# EAGLE design working (EAGLE 9.2.0)
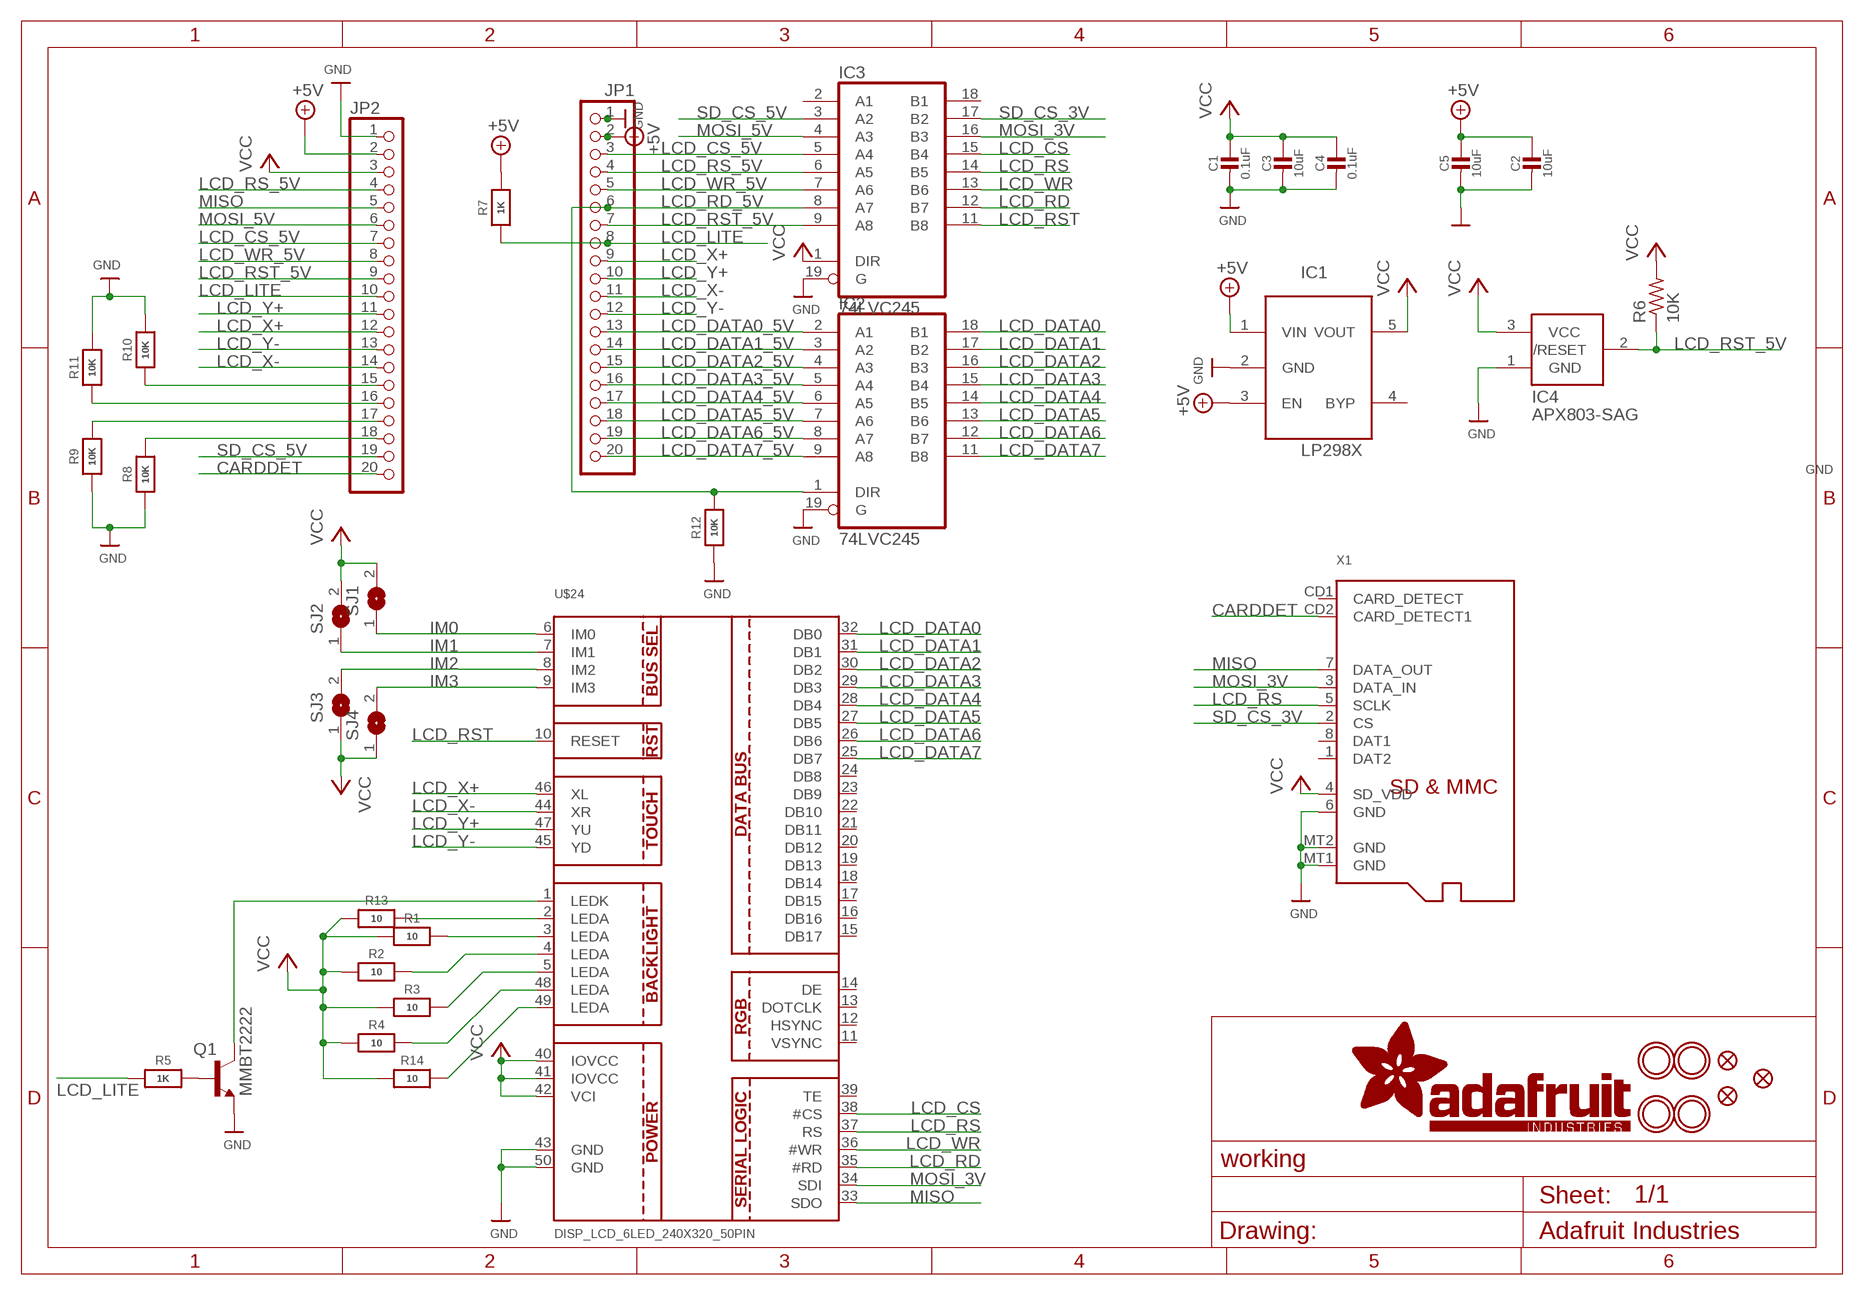
[diagram p0: schematic, sheet 1]

## Parts
C1  0.1uF  CAP_CERAMIC0805-NOOUTLINE  [0805-NO]
C2  10uF  CAP_CERAMIC0805-NOOUTLINE  [0805-NO]
C3  10uF  CAP_CERAMIC0805-NOOUTLINE  [0805-NO]
C4  0.1uF  CAP_CERAMIC0805-NOOUTLINE  [0805-NO]
C5  10uF  CAP_CERAMIC0805-NOOUTLINE  [0805-NO]
IC1  APA2112-3.3  LP298XS  [SOT23-5L]
IC2  74LVC245  74ACT245DW  [SO20W]
IC3  74LVC245  74ACT245DW  [SO20W]
IC4  APX803-SAG  AXP083-SAG  [SOT23]
JP1  HEADER-1X20ROUND  [1X20_ROUND]
JP2  HEADER-1X20ROUND  [1X20_ROUND]
Q1  MMBT2222  MMBT2222ALT1-NPN-SOT23-BEC  [SOT23-BEC]
R1  10  RESISTOR0805_NOOUTLINE  [0805-NO]
R2  10  RESISTOR0805_NOOUTLINE  [0805-NO]
R3  10  RESISTOR0805_NOOUTLINE  [0805-NO]
R4  10  RESISTOR0805_NOOUTLINE  [0805-NO]
R5  1K  RESISTOR0805_NOOUTLINE  [0805-NO]
R6  10K  R-US_R0805  [R0805]
R7  1K  RESISTOR0805_NOOUTLINE  [0805-NO]
R8  10K  RESISTOR0805_NOOUTLINE  [0805-NO]
R9  10K  RESISTOR0805_NOOUTLINE  [0805-NO]
R10  10K  RESISTOR0805_NOOUTLINE  [0805-NO]
R11  10K  RESISTOR0805_NOOUTLINE  [0805-NO]
R12  10K  RESISTOR0805_NOOUTLINE  [0805-NO]
R13  10  RESISTOR0805_NOOUTLINE  [0805-NO]
R14  10  RESISTOR0805_NOOUTLINE  [0805-NO]
SJ1  SOLDERJUMPER  [SOLDERJUMPER_ARROW_NOPASTE]
SJ2  SOLDERJUMPER  [SOLDERJUMPER_ARROW_NOPASTE]
SJ3  SOLDERJUMPER  [SOLDERJUMPER_ARROW_NOPASTE]
SJ4  SOLDERJUMPER  [SOLDERJUMPER_ARROW_NOPASTE]
U$7  MOUNTINGHOLE3.0THIN  [MOUNTINGHOLE_3.0_PLATEDTHIN]
U$9  FIDUCIAL""  [FIDUCIAL_1MM]
U$11  FIDUCIAL""  [FIDUCIAL_1MM]
U$15  MOUNTINGHOLE3.0THIN  [MOUNTINGHOLE_3.0_PLATEDTHIN]
U$16  MOUNTINGHOLE3.0THIN  [MOUNTINGHOLE_3.0_PLATEDTHIN]
U$17  MOUNTINGHOLE3.0THIN  [MOUNTINGHOLE_3.0_PLATEDTHIN]
U$23  FIDUCIAL""  [FIDUCIAL_1MM]
U$24  DISP_LCD_6LED_240X320_50PIN  [TFT_3.2IN_240X320_50PIN]
X1  MICROSD  [MICROSD]

## Nets
+5V: C2.1 C5.1 IC1.1(VIN) IC1.3(EN) JP1.2 JP2.2 R7.2
CARDDET: JP2.20 X1.CD2(CARD_DETECT1)
GND: C1.2 C2.2 C3.2 C4.2 C5.2 IC1.2(GND) IC2.19(G) IC3.19(G) IC4.1(GND) JP1.1 JP2.1 Q1.E R8.1 R9.1 R10.2 R11.2 R12.1 U$24.43(GND) U$24.50(GND) X1.6(GND) X1.MT1(GND) X1.MT2(GND)
IM0: JP2.18 R8.2 SJ1.1 U$24.6(IM0)
IM1: JP2.17 R9.2 SJ2.1 U$24.7(IM1)
IM2: JP2.16 R11.1 SJ3.2 U$24.8(IM2)
IM3: JP2.15 R10.1 SJ4.2 U$24.9(IM3)
LCD_CS: IC3.15(B4) U$24.38(#CS)
LCD_CS_5V: IC3.5(A4) JP1.3 JP2.7
LCD_DATA0: IC2.18(B1) U$24.32(DB0)
LCD_DATA0_5V: IC2.2(A1) JP1.13
LCD_DATA1: IC2.17(B2) U$24.31(DB1)
LCD_DATA1_5V: IC2.3(A2) JP1.14
LCD_DATA2: IC2.16(B3) U$24.30(DB2)
LCD_DATA2_5V: IC2.4(A3) JP1.15
LCD_DATA3: IC2.15(B4) U$24.29(DB3)
LCD_DATA3_5V: IC2.5(A4) JP1.16
LCD_DATA4: IC2.14(B5) U$24.28(DB4)
LCD_DATA4_5V: IC2.6(A5) JP1.17
LCD_DATA5: IC2.13(B6) U$24.27(DB5)
LCD_DATA5_5V: IC2.7(A6) JP1.18
LCD_DATA6: IC2.12(B7) U$24.26(DB6)
LCD_DATA6_5V: IC2.8(A7) JP1.19
LCD_DATA7: IC2.11(B8) U$24.25(DB7)
LCD_DATA7_5V: IC2.9(A8) JP1.20
LCD_LITE: JP1.8 JP2.10 R5.1 R7.1
LCD_RD: IC3.12(B7) U$24.35(#RD)
LCD_RD_5V: IC2.1(DIR) IC3.8(A7) JP1.6 R12.2
LCD_RS: IC3.14(B5) U$24.37(RS) X1.5(SCLK)
LCD_RS_5V: IC3.6(A5) JP1.4 JP2.4
LCD_RST: IC3.11(B8) U$24.10(RESET)
LCD_RST_5V: IC3.9(A8) IC4.2(/RESET) JP1.7 JP2.9 R6.1
LCD_WR: IC3.13(B6) U$24.36(#WR)
LCD_WR_5V: IC3.7(A6) JP1.5 JP2.8
LCD_X+: JP1.9 JP2.12 U$24.46(XL)
LCD_X-: JP1.11 JP2.14 U$24.44(XR)
LCD_Y+: JP1.10 JP2.11 U$24.47(YU)
LCD_Y-: JP1.12 JP2.13 U$24.45(YD)
MISO: JP2.5 U$24.33(SDO) X1.7(DATA_OUT)
MOSI_3V: IC3.16(B3) U$24.34(SDI) X1.3(DATA_IN)
MOSI_5V: IC3.4(A3) JP2.6
N$1: R4.2 U$24.48(LEDA)
N$2: R1.2 U$24.3(LEDA)
N$3: R2.2 U$24.4(LEDA)
N$4: R3.2 U$24.5(LEDA)
N$5: Q1.C U$24.1(LEDK)
N$6: R14.2 U$24.49(LEDA)
N$7: R13.2 U$24.2(LEDA)
N$16: Q1.B R5.2
SD_CS_3V: IC3.17(B2) X1.2(CS)
SD_CS_5V: IC3.3(A2) JP2.19
VCC: C1.1 C3.1 C4.1 IC1.5(VOUT) IC3.1(DIR) IC4.3(VCC) JP2.3 R1.1 R2.1 R3.1 R4.1 R6.2 R13.1 R14.1 SJ1.2 SJ2.2 SJ3.1 SJ4.1 U$24.40(IOVCC) U$24.41(IOVCC) U$24.42(VCI) X1.4(SD_VDD)
Unconnected: IC1.4(BYP) IC3.2(A1) IC3.18(B1) U$24.11(VSYNC) U$24.12(HSYNC) U$24.13(DOTCLK) U$24.14(DE) U$24.15(DB17) U$24.16(DB16) U$24.17(DB15) U$24.18(DB14) U$24.19(DB13) U$24.20(DB12) U$24.21(DB11) U$24.22(DB10) U$24.23(DB9) U$24.24(DB8) U$24.39(TE) X1.1(DAT2) X1.8(DAT1) X1.CD1(CARD_DETECT)

## Power pins joined to a net without a drawn wire
GND: IC2.10(GND) IC3.10(GND)
VCC: IC2.20(VCC) IC3.20(VCC)

## Library data of the parts
C1-C5 = microbuilder:CAP_CERAMIC: Ceramic Capacitors For new designs, use the packages preceded by an '_' character since they are more reliable: The following footprints should be used on most boards: _0402 - Standard footprint for regular board layouts _0603 - Standard footprint for regular board layouts _0805 - Standard footprint for regular board layouts _1206 - Standard footprint for regular board layouts For extremely tight-pitch boards where space is at a premium, the following 'micro-pitch' footprints can be used (smaller pads, no silkscreen outline, etc.): _0402MP - Micro-pitch footprint for very dense/compact boards _0603MP - Micro-pitch footprint for very dense/compact boards _0805MP - Micro-pitch footprint for very dense/compact boards _1206MP - Micro-pitch footprint for very dense/compact boards
IC1 = adafruit:LP298X
IC2 IC3 = 74xx-eu:74*245: Octal BUS TRANSCEIVER, 3-state
IC4 = adafruit:AXP083
JP1 JP2 = microbuilder:HEADER-1X20
Q1 = transistor-neu-to92:*-NPN-: NPN Transistror
R1-R5 R7-R14 = microbuilder:RESISTOR: Resistors For new designs, use the packages preceded by an '_' character since they are more reliable: The following footprints should be used on most boards: _0402 - Standard footprint for regular board layouts _0603 - Standard footprint for regular board layouts _0805 - Standard footprint for regular board layouts _1206 - Standard footprint for regular board layouts For extremely tight-pitch boards where space is at a premium, the following 'micro-pitch' footprints can be used (smaller pads, no silkscreen outline, etc.): _0402MP - Micro-pitch footprint for very dense/compact boards _0603MP - Micro-pitch footprint for very dense/compact boards _0805MP - Micro-pitch footprint for very dense/compact boards _1206MP - Micro-pitch footprint for very dense/compact boards
R6 = rcl:R-US_: RESISTOR, American symbol
SJ1-SJ4 = microbuilder:SOLDERJUMPER: SMD Solder JUMPER Solder the two pads together to create a connection, or remove the solder to break it. REFLOW - Use this footprint for solder paste and reflow ovens. WAVE - Use this footprint for hand-soldering (larger pads). CLOSED - Has a trace between the two pads to ensure it is closed by default. The trace needs to be cut to disable the jumper, and can be closed again by creating a solder bridge between the two pads.; BOM: EXCLUDE
U$7 U$15-U$17 = microbuilder:MOUNTINGHOLE: Mounting Hole For #2 screws (0.086"/2.18mm width, 0.094"/2.4mm hole) use 2.5mm; BOM: EXCLUDE
U$9 U$11 U$23 = microbuilder:FIDUCIAL: Fiducial Alignment Points Various fiducial points for machine vision alignment.; BOM: EXCLUDE
U$24 = microbuilder:DISP_LCD_6LED_240X320_50PIN
X1 = microbuilder:MICROSD: MicroSD/Transflash Card Holder with SPI pinout 3M: 2908-05WB-MG 4UConnector: 19656 Footprint courtesy: Adafruit Industries

## Board
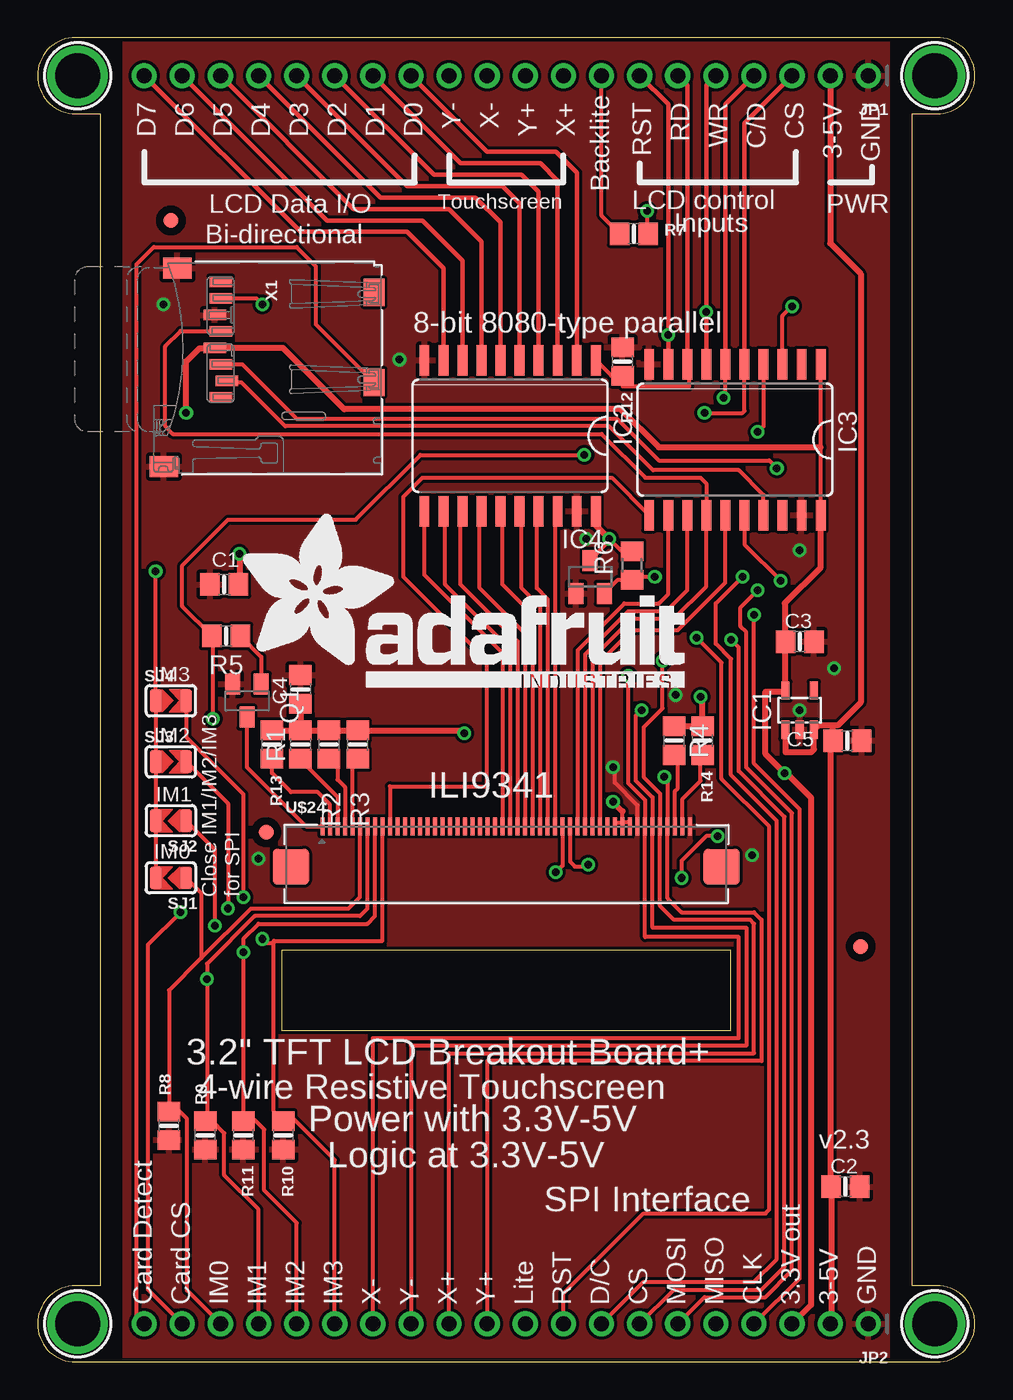
[diagram p1: board, top side]
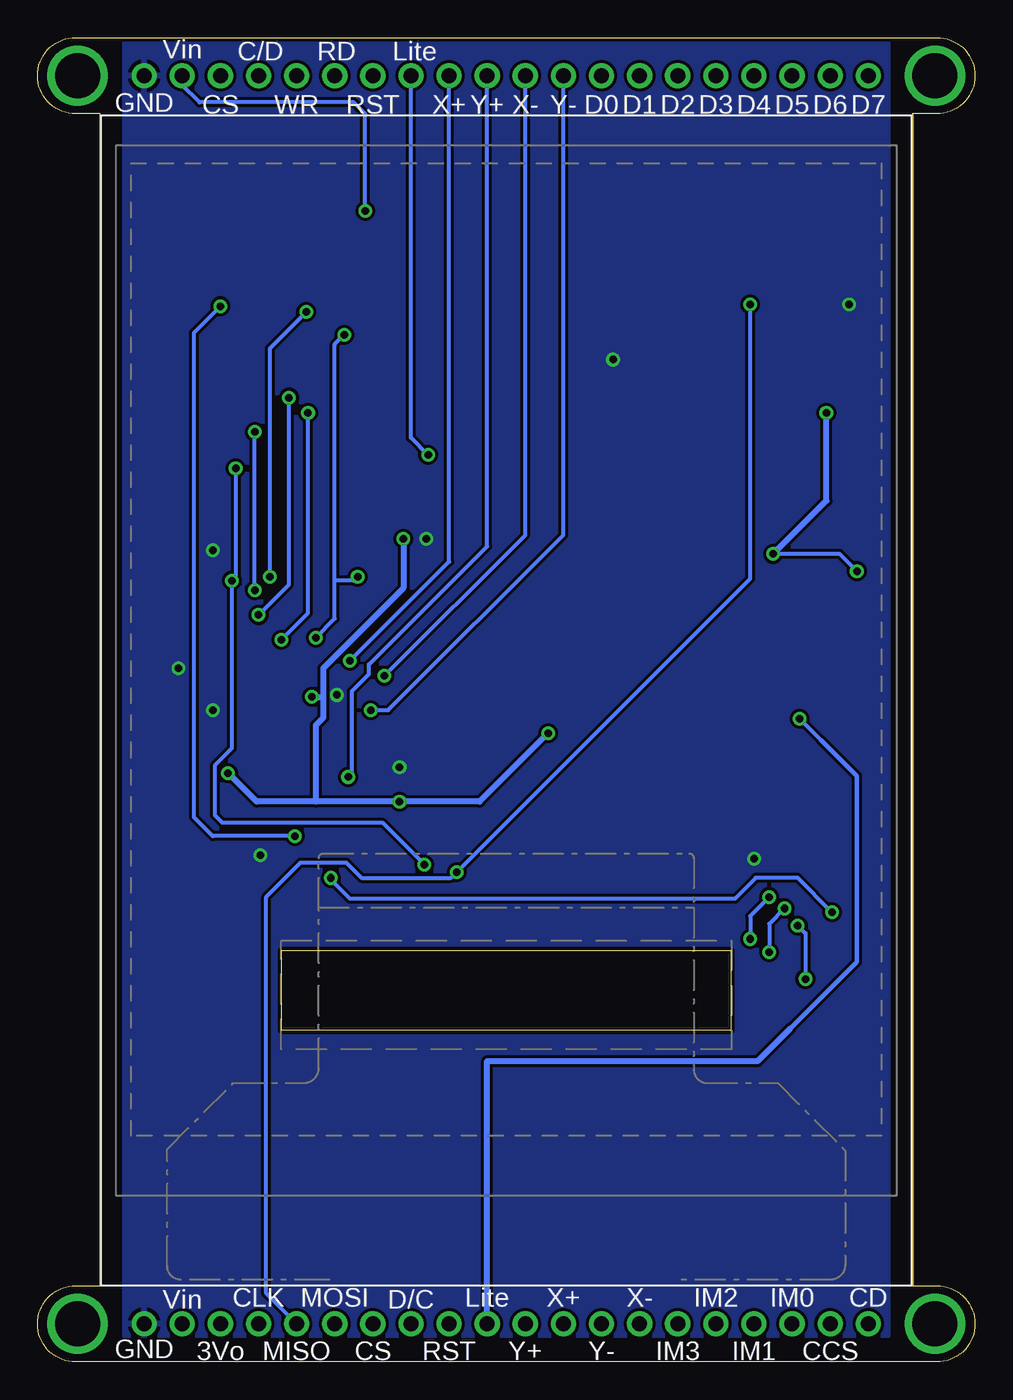
[diagram p2: board, bottom side, seen from below]

Size 62.48 x 88.27 mm. Coordinates in mm from the lower left corner, seen from the top.
Outline: 0,2.54 arc90 2.54,0 59.94,0 arc90 62.48,2.54 arc90 59.94,5.08 58.29,5.08 58.29,83.19 59.94,83.19 arc90 62.48,85.72 arc90 59.94,88.27 2.54,88.27 arc90 0,85.72 arc90 2.54,83.19 4.19,83.19 4.19,5.08 2.54,5.08 arc90 0,2.54
Outline: 16.26,27.43 16.26,22.1 46.23,22.1 46.23,27.43 16.26,27.43
Copper layers (1*16): Top 0.035mm / dielectric 1.5mm / Bottom 0.035mm
Design rules "adafruit *": minimum track width 8mil, minimum drill 15.5mil, track to track 8mil, track to pad 8mil, pad to pad 8mil, via to via 8mil, smd to smd 8mil, copper to edge 10mil, drill to drill 8mil, minimum pad ring 10mil, minimum via ring 8mil, stop-mask expansion 4mil, vias tented up to drill 20mil, thermal gap 10mil

### Footprints (pad centres in the part's own frame; a part is rotated, then mirrored left to right if it is on the bottom)
0805-NO = smd 1.3 x 1.5: 1 -0.95,0; 2 0.95,0
SOT23-5L = smd 0.55 x 1.2: 1 -0.95,-1.3; 2 0,-1.3; 3 0.95,-1.3; 4 0.95,1.3; 5 -0.95,1.3
SO20W = smd 0.66 x 2.032: 1 -5.715,-5.029; 2 -4.445,-5.029; 3 -3.175,-5.029; 4 -1.905,-5.029; 5 -0.635,-5.029; 6 0.635,-5.029; 7 1.905,-5.029; 8 3.175,-5.029; 9 4.445,-5.029; 10 5.715,-5.029; 11 5.715,5.029; 12 4.445,5.029; 13 3.175,5.029; 14 1.905,5.029; 15 0.635,5.029; 16 -0.635,5.029; 17 -1.905,5.029; 18 -3.175,5.029; 19 -4.445,5.029; 20 -5.715,5.029
SOT23 = smd 1 x 1.4: 1 -0.95,-1.1; 2 0.95,-1.1; 3 0,1.1
1X20_ROUND = drill 1 pad 1.676: 1 -24.13,0; 2 -21.59,0; 3 -19.05,0; 4 -16.51,0; 5 -13.97,0; 6 -11.43,0; 7 -8.89,0; 8 -6.35,0; 9 -3.81,0; 10 -1.27,0; 11 1.27,0; 12 3.81,0; 13 6.35,0; 14 8.89,0; 15 11.43,0; 16 13.97,0; 17 16.51,0; 18 19.05,0; 19 21.59,0; 20 24.13,0
SOT23-BEC = smd 1 x 1.4: B -0.95,-1.1; C 0,1.1; E 0.95,-1.1
R0805 = smd 1.3 x 1.5: 1 -0.95,0; 2 0.95,0
SOLDERJUMPER_ARROW_NOPASTE = smd 0.762 x 1.524: 1 -1.016,0; 2 1.016,0
MOUNTINGHOLE_3.0_PLATEDTHIN = drill 3 pad 3.6: P$1 0,0
FIDUCIAL_1MM = smd 1 x 1: 1 0,0
TFT_3.2IN_240X320_50PIN = smd 0.275 x 1.2 bottom: 1 12.25,-9.39; 2 11.75,-9.39; 3 11.25,-9.39; 4 10.75,-9.39; 5 10.25,-9.39; 6 9.75,-9.39; 7 9.25,-9.39; 8 8.75,-9.39; 9 8.25,-9.39; 10 7.75,-9.39; 11 7.25,-9.39; 12 6.75,-9.39; 13 6.25,-9.39; 14 5.75,-9.39; 15 5.25,-9.39; 16 4.75,-9.39; 17 4.25,-9.39; 18 3.75,-9.39; 19 3.25,-9.39; 20 2.75,-9.39; 21 2.25,-9.39; 22 1.75,-9.39; 23 1.25,-9.39; 24 0.75,-9.39; 25 0.25,-9.39; 26 -0.25,-9.39; 27 -0.75,-9.39; 28 -1.25,-9.39; 29 -1.75,-9.39; 30 -2.25,-9.39; 31 -2.75,-9.39; 32 -3.25,-9.39; 33 -3.75,-9.39; 34 -4.25,-9.39; 35 -4.75,-9.39; 36 -5.25,-9.39; 37 -5.75,-9.39; 38 -6.25,-9.39; 39 -6.75,-9.39; 40 -7.25,-9.39; 41 -7.75,-9.39; 42 -8.25,-9.39; 43 -8.75,-9.39; 44 -9.25,-9.39; 45 -9.75,-9.39; 46 -10.25,-9.39; 47 -10.75,-9.39; 48 -11.25,-9.39; 49 -11.75,-9.39; 50 -12.25,-9.39 | smd 2.4 x 2.4 bottom: PAD1 14.35,-12.09; PAD2 -14.35,-12.09
MICROSD = smd 0.7 x 1.5: 1 9,-10.64; 2 7.9,-10.24; 3 6.8,-10.64; 4 5.7,-11.04; 5 4.6,-10.64; 6 3.5,-11.04; 7 2.4,-10.64; 8 1.3,-10.64 | smd 1.8 x 1.4: CD1 2,-0.44; CD2 8,-0.44 | smd 1.4 x 1.9: MT1 0.4,-13.54; MT2 13.6,-14.44

### Placement (x,y rotation side)
C1  12.45,51.82 180 top
C2  53.85,11.68 0 top
C3  50.8,48.01 0 top
C4  17.53,44.83 90 top
C5  53.98,41.4 0 top
IC1  50.8,43.43 0 top
IC2  31.5,61.72 180 top
IC3  46.48,61.47 180 top
IC4  36.83,52.32 0 top
JP1  31.24,85.72 180 top
JP2  31.24,2.54 180 top
Q1  13.97,44.07 180 top
R1  17.53,41.15 270 top
R2  19.43,41.15 270 top
R3  21.34,41.15 270 top
R4  42.42,41.4 270 top
R5  12.57,48.39 0 top
R6  39.62,53.09 90 top
R7  39.75,75.18 0 top
R8  8.76,15.75 90 top
R9  11.18,15.11 90 top
R10  16.38,15.11 270 top
R11  13.72,15.11 270 top
R12  38.99,66.67 270 top
R13  15.62,41.15 270 top
R14  44.32,41.4 270 top
SJ1  8.89,32.26 180 top
SJ2  8.89,36.07 180 top
SJ3  8.89,40.01 0 top
SJ4  8.89,44.07 0 top
U$7  2.67,2.54 0 top
U$9  54.86,27.69 0 top
U$11  8.89,76.07 0 top
U$15  59.82,2.54 0 top
U$16  2.67,85.72 0 top
U$17  59.82,85.72 0 top
U$19  [ADAFRUIT_TEXT_30MM]  13.46,44.96 0 top
U$23  15.24,35.31 0 top
U$24  31.24,45.09 0 bottom
X1  22.86,73.28 270 top

### Tracks (layer width: path | path; a pad name or v marks a point on that pad's centre or on a via)
+5V  (via drill 0.5)
  Top 0.254: R7.2 40.64,75.25 v40.64,76.71
  Top 0.406: JP1.2 52.83,74.55 54.86,72.52 54.86,43.94 53.34,42.42 52.96,42.42 | 52.96,42.42 52.03,42.42 IC1.3 51.75,40.83 51.56,40.64 49.85,40.64 IC1.1 | 52.85,2.56 JP2.2 52.9,2.61 C2.1 52.83,11.75 52.83,41.21 C5.1 53.03,42.35 52.96,42.42
  Bottom 0.254: v40.64,76.71 40.64,83.19 41.4,83.95 51.69,83.95 52.83,85.09 JP1.2
CARDDET
  Top 0.254: JP2.20 6.6,3.05 6.6,73.15 7.75,74.3 17.27,74.3 18.54,73.03 18.54,69.16 X1.CD2
GND  (via drill 0.5)
  Top 0.254: U$24.43 39.99,37.1 38.48,38.61 38.48,39.5 v38.35,39.62
  other vias: 36.58,54.86 50.8,54.1 42.55,44.45 50.8,43.43 53.09,46.23 14.73,33.53 8.38,70.48 24.13,66.8 47.62,33.78
  pour Top: 5.84,88.27 5.84,0 56.64,0 56.64,88.27
  pour Bottom: 5.84,88.01 5.84,1.78 56.64,1.78 56.64,88.01
IM0
  Top 0.254: 10.92,26.92 8.76,24.77 R8.2 9.46,16.7 9.97,16.2 9.97,4.77 JP2.18 | 10.92,26.92 14.22,30.23 20.73,30.23 21.49,30.99 U$24.6 | SJ1.1 10.92,31.24 10.92,26.92
IM1  (via drill 0.5)
  Top 0.254: JP2.17 14.73,10.16 12.45,12.45 12.45,15.24 11.62,16.06 R9.2 11.3,16.19 v11.3,25.53 | SJ2.1 11.81,34.16 v11.81,29.08 | v11.3,25.53 11.29,25.51 | U$24.7 21.99,30.23 21.48,29.72 14.48,29.72 11.3,26.54 v11.3,25.53
  Bottom 0.254: v11.81,29.08 11.3,28.57 v11.3,25.53
IM2  (via drill 0.5)
  Top 0.254: JP2.16 17.27,9.27 15.11,11.43 15.11,15.49 14.48,16.13 13.72,16.13 | 13.72,16.13 13.66,16.13 | SJ3.2 12.7,37.21 v12.7,30.23 | U$24.8 22.49,29.72 21.98,29.21 14.73,29.21 13.72,28.19 v13.72,27.3 13.72,16.13 | R11.1 13.72,16.13
  Bottom 0.254: v12.7,30.23 13.72,29.21 v13.72,27.3
IM3  (via drill 0.5)
  Top 0.254: JP2.15 19.81,13.46 17.02,16.26 16.58,16.26 R10.1 15.75,16.7 15.75,27.94 | 15.75,27.94 15.75,28.07 22.99,28.07 U$24.9 | 9.91,44.45 SJ4.2 9.91,41.66 13.72,37.85 v13.72,30.99 | v14.99,28.19 15.24,27.94 15.75,27.94
  Bottom 0.254: v13.72,30.99 14.99,29.72 v14.99,28.19
LCD_CS
  Top 0.254: 45.97,56.31 IC3.15 45.85,51.94 42.67,48.77 39.62,48.77 37.49,46.64 U$24.38
LCD_CS_5V  (via drill 0.5)
  Top 0.254: JP2.7 42.42,4.83 48.26,4.83 49.78,6.35 49.78,36.32 46.74,39.37 46.74,47.62 v46.23,48.13 | v44.45,63.25 46.99,63.25 47.12,63.37 IC3.5
  Top 0.305: JP1.3 47.12,82.55 IC3.5
  Bottom 0.254: v46.23,48.13 44.45,49.91 v44.45,63.25
LCD_DATA0
  Top 0.254: IC2.18 34.49,56.51 U$24.32
LCD_DATA0_5V
  Top 0.305: JP1.13 29.97,80.65 34.54,80.65 35.94,79.25 IC2.2
LCD_DATA1
  Top 0.254: IC2.17 33.27,56.57 33.27,51.56 33.99,50.84 U$24.31
LCD_DATA1_5V
  Top 0.305: JP1.14 28.19,79.88 33.53,79.88 34.67,78.74 IC2.3
LCD_DATA2
  Top 0.254: IC2.16 32.26,56.57 32.26,51.56 33.49,50.33 U$24.30
LCD_DATA2_5V
  Top 0.305: JP1.15 26.42,79.12 32.26,79.12 33.4,77.98 IC2.4
LCD_DATA3
  Top 0.254: IC2.15 30.99,56.57 30.99,51.82 32.99,49.81 U$24.29
LCD_DATA3_5V
  Top 0.305: JP1.16 24.64,78.36 30.99,78.36 32.13,77.22 IC2.5
LCD_DATA4
  Top 0.254: IC2.14 29.46,56.57 29.46,51.56 32.49,48.53 U$24.28
LCD_DATA4_5V
  Top 0.305: JP1.17 22.86,77.6 29.21,77.6 30.86,75.95 IC2.6
LCD_DATA5
  Top 0.254: IC2.13 28.19,56.57 28.19,51.82 31.99,48.02 U$24.27
LCD_DATA5_5V
  Top 0.305: JP1.18 21.08,76.84 27.43,76.84 29.59,74.68 IC2.7
LCD_DATA6
  Top 0.254: IC2.12 27.18,56.57 27.18,51.82 31.49,47.5 U$24.26
LCD_DATA6_5V
  Top 0.305: JP1.19 19.3,76.07 25.65,76.07 28.32,73.41 IC2.8
LCD_DATA7
  Top 0.254: IC2.11 25.78,52.45 30.99,47.24 U$24.25
LCD_DATA7_5V
  Top 0.305: JP1.20 17.53,75.31 24.64,75.31 27.05,72.9 IC2.9
LCD_LITE  (via drill 0.5)
  Top 0.254: v36.45,60.45 25.53,60.45 21.21,56.13 12.7,56.13 9.65,53.09 9.65,50.36 R5.1 11.68,48.33 v11.68,42.86 | R7.1 37.59,76.39 JP1.8
  Bottom 0.254: v36.45,60.45 37.59,61.59 JP1.8 | v11.68,42.86 10.29,41.46
  Bottom 0.305: 12.32,22.23 7.87,26.67 7.87,39.05 10.29,41.46
  Bottom 0.406: JP2.10 32.51,20.07 14.48,20.07 12.32,22.23
LCD_RD
  Top 0.254: 41.91,56.31 IC3.12 42.04,51.18 41.4,50.55 39.12,50.55 35.99,47.42 U$24.35
LCD_RD_5V
  Top 0.254: IC3.8 43.43,66.37 43.43,65.02 38.99,65.02 R12.2 | R12.2 38.99,66.04 38.86,65.91 | IC2.1 38.24,65.72 R12.2
  Top 0.305: JP1.6 43.31,85.09 IC3.8
LCD_RS
  Top 0.254: 44.45,56.31 IC3.14 | IC3.14 44.58,51.69 42.42,49.53 39.62,49.53 36.99,46.9 U$24.37 | IC3.14 44.58,58.55 44.2,58.93 40.51,58.93 37.59,61.85 9.02,61.85 8.51,62.36 8.51,67.69 9.53,68.71 12.19,68.71 X1.5
LCD_RS_5V  (via drill 0.5)
  Top 0.254: v47.75,49.78 47.75,39.88 50.8,36.83 50.8,5.59 JP2.4 | v45.72,64.26 45.85,64.39 IC3.6
  Top 0.305: JP1.4 45.85,83.82 IC3.6
  Bottom 0.254: v47.75,49.78 45.72,51.82 v45.72,64.26
LCD_RST
  Top 0.254: IC3.11 38.28,58.93 25.65,58.93 24.38,57.66 24.38,52.32 29.97,46.74 29.97,38.35 23.49,38.35 U$24.10
LCD_RST_5V  (via drill 0.5)
  Top 0.254: JP2.9 35.05,4.57 40.39,9.91 48.51,9.91 48.77,10.16 48.77,35.69 45.59,38.86 45.59,46.61 v43.94,48.26 | v42.04,68.45 IC3.9 | IC4.2 38.69,52.14 R6.1 39.81,52.32 v41.15,52.32
  Top 0.305: JP1.7 42.04,83.82 IC3.9
  Bottom 0.254: v43.94,48.26 42.67,49.53 42.67,52.07 | 42.67,52.07 42.67,67.82 v42.04,68.45 | v41.15,52.32 41.4,52.07 42.67,52.07
LCD_WR
  Top 0.254: 43.43,56.31 IC3.13 43.31,51.44 41.91,50.04 39.37,50.04 36.49,47.16 U$24.36
LCD_WR_5V  (via drill 0.5)
  Top 0.254: JP2.8 40.39,5.33 47.75,5.33 49.28,6.86 49.28,36.07 46.23,39.12 46.23,46.86 45.21,47.88 45.21,50.55 v46.99,52.32 | 44.7,66.37 IC3.7
  Top 0.305: JP1.5 44.58,85.09 v44.58,69.98 IC3.7
  Bottom 0.254: v46.99,52.32 46.99,67.56 v44.58,69.98
LCD_X+  (via drill 0.5)
  Top 0.254: v41.66,46.74 41.66,43.56 40.39,42.29 40.39,38.99 41.49,37.88 U$24.46 41.49,30.39 42.42,29.46 47.5,29.46 47.75,29.21 47.75,20.57 27.43,20.57 JP2.12
  Bottom 0.254: v41.66,46.74 35.05,53.34 JP1.9
LCD_X-  (via drill 0.5)
  Top 0.254: v39.37,45.72 39.37,38.57 40.49,37.44 U$24.44 40.49,28.32 46.74,28.32 46.74,21.59 22.35,21.59 JP2.14
  Bottom 0.254: v39.37,45.72 29.97,55.12 JP1.11
LCD_Y+  (via drill 0.5)
  Top 0.254: JP2.11 29.97,20.07 48.26,20.07 48.26,29.46 47.75,29.97 42.93,29.97 41.99,30.91 U$24.47 41.99,38.82 41.95,38.82 v41.78,38.99
  Bottom 0.254: JP1.10 32.51,54.36 40.39,46.48 40.39,45.85 41.53,44.7 41.53,39.24 v41.78,38.99
LCD_Y-  (via drill 0.5)
  Top 0.254: JP2.13 24.89,21.08 47.24,21.08 47.24,28.96 40.99,28.96 U$24.45 40.99,37.62 39.88,38.73 39.88,43.05 v40.26,43.43
  Bottom 0.254: v40.26,43.43 39.12,43.43 27.43,55.12 JP1.12
MISO  (via drill 0.5)
  Top 0.254: v14.99,70.48 14.59,70.88 X1.7 | U$24.33 34.99,33.09 v34.54,32.64
  Bottom 0.254: JP2.5 47.24,4.57 47.24,30.99 44.96,33.27 41.91,33.27 40.89,32.26 34.92,32.26 v34.54,32.64 14.99,52.2 v14.99,70.48
MOSI_3V  (via drill 0.5)
  Top 0.254: IC3.16 47.12,54.48 v49.53,52.07 | v49.28,59.56 48.77,60.07 41.4,60.07 38.61,62.86 17.27,62.86 13.66,66.48 X1.3 | U$24.34 35.49,33.34 35.81,33.02 36.58,33.02 v36.7,33.15
  Bottom 0.254: v36.7,33.15 39.5,35.94 50.16,35.94 50.67,36.45 50.67,39.75 49.53,40.89 v49.53,52.07 49.28,52.32 v49.28,59.56
MOSI_5V  (via drill 0.5)
  Top 0.254: JP2.6 44.45,4.32 48.51,4.32 50.29,6.1 50.29,36.58 47.24,39.62 47.24,48.64 46.86,49.02 46.86,50.29 v48.01,51.44 | IC3.4 48.39,62.36 v48.01,61.98
  Bottom 0.254: v48.01,51.44 v48.01,61.98
N$1
  Top 0.254: U$24.48 42.49,38.05 42.67,38.23 42.67,40.2 R4.2
N$2
  Top 0.254: R1.2 17.78,39.94 17.78,39.88 19.99,37.67 U$24.3
N$3
  Top 0.254: R2.2 19.99,39.64 19.99,38.81 20.49,38.31 U$24.4
N$4
  Top 0.254: U$24.5 20.99,39.85 R3.2
N$5
  Top 0.254: Q1.C 13.97,39.62 17.9,35.7 U$24.1
N$6
  Top 0.254: U$24.49 42.99,37.53 44.2,38.73 44.2,40.45 R14.2
N$7
  Top 0.254: U$24.2 19.49,37.15 18.67,37.97 16.89,37.97 15.62,39.24 R13.2
N$16
  Top 0.254: R5.2 14.92,46.99 Q1.B
SD_CS_3V
  Top 0.254: IC3.17 48.39,57.78 46.74,59.44 41.02,59.44 38.1,62.36 16.51,62.36 13.59,65.28 12.72,65.28 X1.2
SD_CS_5V  (via drill 0.5)
  Top 0.254: IC3.3 49.66,69.72 v50.29,70.36 | JP2.19 7.37,4.83 7.37,27.81 v9.53,29.97 | v45.34,35.05 44.58,35.05 42.93,33.4 v42.93,32.26
  Bottom 0.254: v50.29,70.36 52.07,68.58 52.07,36.32 50.8,35.05 v45.34,35.05 | v42.93,32.26 42.93,32.13 41.66,30.86 16,30.86 14.61,32.26 11.81,32.26 v9.53,29.97
VCC  (via drill 0.5)
  Top 0.254: IC3.20 52.2,60.96 IC3.1 | SJ2.2 SJ3.1 SJ4.1 v7.87,52.7 | 7.87,35.56 SJ2.2 | SJ2.2 SJ1.2 | U$24.40 38.49,35.94 38.99,35.94 | U$24.42 39.49,35.94 38.99,35.94 | 38.99,35.94 38.99,36.7 | IC4.3 38.1,54.69 v38.1,54.86 38.93,54.04 R6.2 | 38.99,35.94 U$24.41
  Top 0.406: IC3.20 52.2,52.96 49.8,50.56 49.8,48.06 C3.1 IC1.5 49.78,44.67 48.51,44.67 48.51,40.51 v49.78,39.24 49.8,39.24 49.8,39.35 51.56,37.59 51.56,3.81 JP2.3 | R1.1 R2.1 R3.1 28.26,42.1 v28.45,41.91 | v38.35,37.34 38.99,36.7 | 52.2,60.96 41.4,60.96 38.86,63.5 20.45,63.5 16.37,67.58 X1.4 11.8,67.56 10.8,67.56 9.91,66.67 v9.91,63.25 10.02,63.13 | IC2.20 37.21,55.75 v38.1,54.86 | R13.1 R1.1 | C4.1 R1.1 | R4.1 R14.1 44.32,44.2 v44.2,44.32 | v13.46,53.85 13.46,51.88 C1.1
  Bottom 0.254: v7.87,52.7 9.02,53.85 v13.46,53.85
  Bottom 0.406: v28.45,41.91 33.02,37.34 v38.35,37.34 43.94,37.34 | 43.94,37.34 47.88,37.34 v49.78,39.24 | 43.43,44.32 43.43,46.23 38.1,51.56 v38.1,54.86 | 43.43,44.32 43.43,42.93 43.94,42.42 43.94,37.34 | v13.46,53.85 9.91,57.4 v9.91,63.25 | v44.2,44.32 43.43,44.32

### Text on the board
tPlace: D7 | D6 | D5 | D4 | D3 | D2 | D1 | D0 | Y- | X- | Y+ | X+ | Backlite | RST | RD | WR | C/D | CS | 3-5V | GND | Touchscreen | LCD control | LCD Data I/O | PWR | Inputs | Bi-directional | 8-bit 8080-type parallel | IM3 | IM2 | IM1 | ILI9341 | IM0 | Close IM1/IM2/IM3 / for SPI | 3.2" TFT LCD Breakout Board+ | 4-wire Resistive Touchscreen | Power with 3.3V-5V | v2.3 | Logic at 3.3V-5V | SPI Interface | Card Detect | Card CS | IM0 | IM1 | IM2 | IM3 | X- | Y- | X+ | Y+ | Lite | RST | D/C | CS | MOSI | MISO | CLK | 3.3V out | 3-5V | GND
bPlace: Lite | RD | C/D | Vin | D7 | D6 | D5 | D4 | D3 | D2 | D1 | D0 | Y- | X- | Y+ | X+ | RST | WR | CS | GND | CD | IM0 | IM2 | X- | X+ | Lite | MOSI | CLK | D/C | Vin | CCS | IM1 | IM3 | Y- | Y+ | RST | CS | MISO | 3Vo | GND